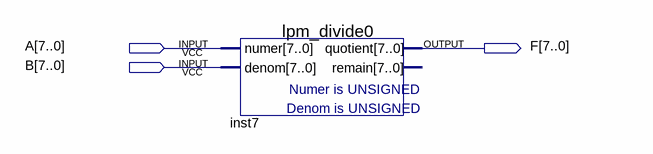
[diagram p0: schematic sheet]
// Quartus schematic A÷B.bdf as structural Verilog: 1 symbols, 3 pins
module \A÷B  (
  input  [7:0] A,
  input  [7:0] B,
  output [7:0] F
);

  lpm_divide0 inst7 (.numer(A), .denom(B), .quotient(F));  // open: remain
endmodule
